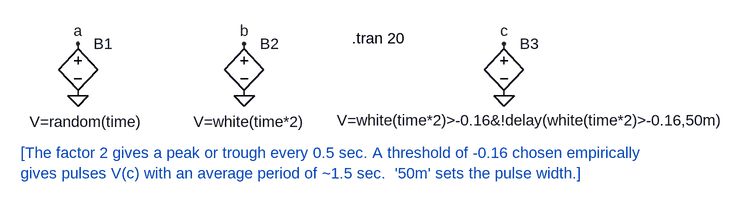
[diagram p0: schematic TestingRandom()&White().asc]
TestingRandom()&White().asc, the LTspice schematic file:
Version 4
SHEET 1 1324 680
FLAG 544 176 0
FLAG -112 96 a
FLAG -112 176 0
FLAG 144 96 b
FLAG 144 176 0
FLAG 544 96 c
SYMBOL bv 544 80 R0
WINDOW 3 -257 134 Left 2
SYMATTR InstName B3
SYMATTR Value V=white(time*2)>-0.16&!delay(white(time*2)>-0.16,50m)
SYMBOL bv -112 80 R0
WINDOW 3 -74 136 Left 2
SYMATTR InstName B1
SYMATTR Value V=random(time)
SYMBOL bv 144 80 R0
WINDOW 3 -78 136 Left 2
SYMATTR InstName B2
SYMATTR Value V=white(time*2)
TEXT 310 88 Left 2 !.tran 20
TEXT -200 264 Left 2 ;[The factor 2 gives a peak or trough every 0.5 sec. A threshold of -0.16 chosen empirically\ngives pulses V(c) with an average period of ~1.5 sec.  '50m' sets the pulse width.]

The netlist it stands for:
* TestingRandom()&White().asc
B3 c 0 V=white(time*2)>-0.16&!delay(white(time*2)>-0.16,50m)
B1 a 0 V=random(time)
B2 b 0 V=white(time*2)
.tran 20
* [The factor 2 gives a peak or trough every 0.5 sec. A threshold of -0.16 chosen empirically
* gives pulses V(c) with an average period of ~1.5 sec.  '50m' sets the pulse width.]
.backanno
.end